# Altium schematic sheet 2_FPGA.SchDoc: AX309 Http://www.heijin.org
size OrCAD A; DocumentNumber: 2; Revision: 1.0; SheetNumber: 2; SheetTotal: 7; PageSetup: Record=PageOptions|CenterHorizontal=True|CenterVertical=True|PrintScale=1.03|XCorrection=1.00|YCorrection=1.00|PrintKind=0|BorderSize=5000000|LeftOffset=0|BottomOffset=0|Orientation=2|PaperLength=1000|PaperWidth=1000|Scale=100|PaperSource=15|PrintQuality=1200|MediaType=1|DitherType=10|PrintScaleMode=1|PaperKind=A4|PaperIndex=9
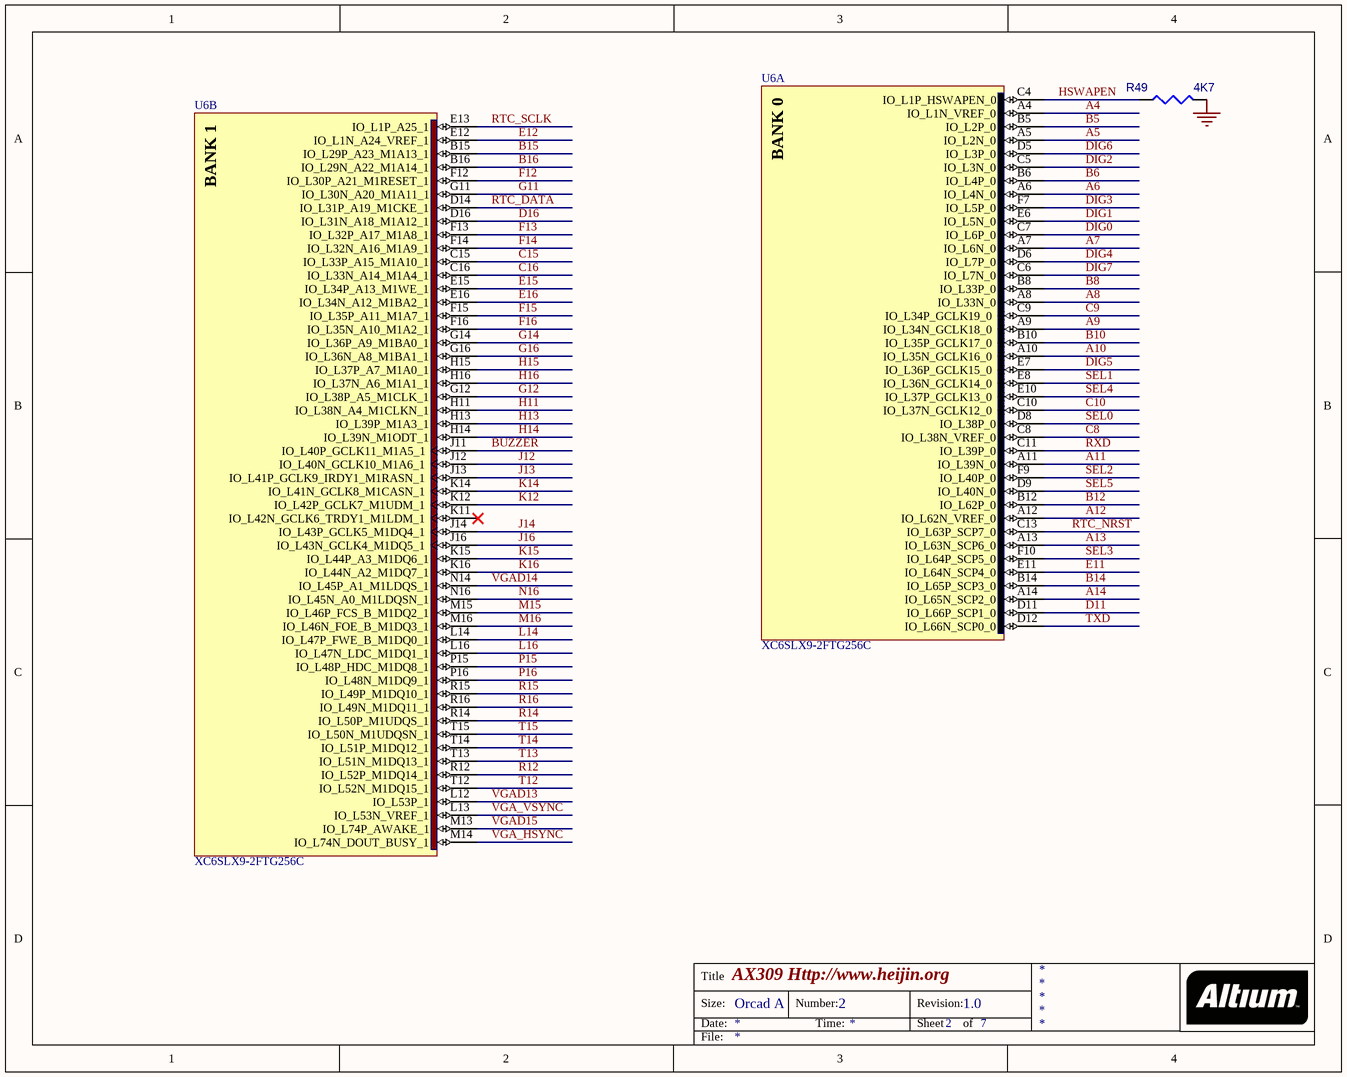
[diagram p0: 2_FPGA.SchDoc]

## Parts
R49  4K7  [0603]
U6  XC6SLX9-2FTG256C  [FTG256]  (parts A,B of 7)

## Nets
GND: R49.2
A4: U6.A4(IO_L1N_VREF_0)
A5: U6.A5(IO_L2N_0)
A6: U6.A6(IO_L4N_0)
A7: U6.A7(IO_L6N_0)
A8: U6.A8(IO_L33N_0)
A9: U6.A9(IO_L34N_GCLK18_0)
A10: U6.A10(IO_L35N_GCLK16_0)
A11: U6.A11(IO_L39N_0)
A12: U6.A12(IO_L62N_VREF_0)
A13: U6.A13(IO_L63N_SCP6_0)
A14: U6.A14(IO_L65N_SCP2_0)
B5: U6.B5(IO_L2P_0)
B6: U6.B6(IO_L4P_0)
B8: U6.B8(IO_L33P_0)
B10: U6.B10(IO_L35P_GCLK17_0)
B12: U6.B12(IO_L62P_0)
B14: U6.B14(IO_L65P_SCP3_0)
B15: U6.B15(IO_L29P_A23_M1A13_1)
B16: U6.B16(IO_L29N_A22_M1A14_1)
BUZZER: U6.J11(IO_L40P_GCLK11_M1A5_1)
C8: U6.C8(IO_L38N_VREF_0)
C9: U6.C9(IO_L34P_GCLK19_0)
C10: U6.C10(IO_L37N_GCLK12_0)
C15: U6.C15(IO_L33P_A15_M1A10_1)
C16: U6.C16(IO_L33N_A14_M1A4_1)
D11: U6.D11(IO_L66P_SCP1_0)
D16: U6.D16(IO_L31N_A18_M1A12_1)
DIG0: U6.C7(IO_L6P_0)
DIG1: U6.E6(IO_L5N_0)
DIG2: U6.C5(IO_L3N_0)
DIG3: U6.F7(IO_L5P_0)
DIG4: U6.D6(IO_L7P_0)
DIG5: U6.E7(IO_L36P_GCLK15_0)
DIG6: U6.D5(IO_L3P_0)
DIG7: U6.C6(IO_L7N_0)
E11: U6.E11(IO_L64N_SCP4_0)
E12: U6.E12(IO_L1N_A24_VREF_1)
E15: U6.E15(IO_L34P_A13_M1WE_1)
E16: U6.E16(IO_L34N_A12_M1BA2_1)
F12: U6.F12(IO_L30P_A21_M1RESET_1)
F13: U6.F13(IO_L32P_A17_M1A8_1)
F14: U6.F14(IO_L32N_A16_M1A9_1)
F15: U6.F15(IO_L35P_A11_M1A7_1)
F16: U6.F16(IO_L35N_A10_M1A2_1)
G11: U6.G11(IO_L30N_A20_M1A11_1)
G12: U6.G12(IO_L38P_A5_M1CLK_1)
G14: U6.G14(IO_L36P_A9_M1BA0_1)
G16: U6.G16(IO_L36N_A8_M1BA1_1)
H11: U6.H11(IO_L38N_A4_M1CLKN_1)
H13: U6.H13(IO_L39P_M1A3_1)
H14: U6.H14(IO_L39N_M1ODT_1)
H15: U6.H15(IO_L37P_A7_M1A0_1)
H16: U6.H16(IO_L37N_A6_M1A1_1)
HSWAPEN: R49.1 U6.C4(IO_L1P_HSWAPEN_0)
J12: U6.J12(IO_L40N_GCLK10_M1A6_1)
J13: U6.J13(IO_L41P_GCLK9_IRDY1_M1RASN_1)
J14: U6.J14(IO_L43P_GCLK5_M1DQ4_1)
J16: U6.J16(IO_L43N_GCLK4_M1DQ5_1)
K12: U6.K12(IO_L42P_GCLK7_M1UDM_1)
K14: U6.K14(IO_L41N_GCLK8_M1CASN_1)
K15: U6.K15(IO_L44P_A3_M1DQ6_1)
K16: U6.K16(IO_L44N_A2_M1DQ7_1)
L14: U6.L14(IO_L47P_FWE_B_M1DQ0_1)
L16: U6.L16(IO_L47N_LDC_M1DQ1_1)
M15: U6.M15(IO_L46P_FCS_B_M1DQ2_1)
M16: U6.M16(IO_L46N_FOE_B_M1DQ3_1)
N16: U6.N16(IO_L45N_A0_M1LDQSN_1)
P15: U6.P15(IO_L48P_HDC_M1DQ8_1)
P16: U6.P16(IO_L48N_M1DQ9_1)
R12: U6.R12(IO_L52P_M1DQ14_1)
R14: U6.R14(IO_L50P_M1UDQS_1)
R15: U6.R15(IO_L49P_M1DQ10_1)
R16: U6.R16(IO_L49N_M1DQ11_1)
RTC_DATA: U6.D14(IO_L31P_A19_M1CKE_1)
RTC_NRST: U6.C13(IO_L63P_SCP7_0)
RTC_SCLK: U6.E13(IO_L1P_A25_1)
RXD: U6.C11(IO_L39P_0)
SEL0: U6.D8(IO_L38P_0)
SEL1: U6.E8(IO_L36N_GCLK14_0)
SEL2: U6.F9(IO_L40P_0)
SEL3: U6.F10(IO_L64P_SCP5_0)
SEL4: U6.E10(IO_L37P_GCLK13_0)
SEL5: U6.D9(IO_L40N_0)
T12: U6.T12(IO_L52N_M1DQ15_1)
T13: U6.T13(IO_L51N_M1DQ13_1)
T14: U6.T14(IO_L51P_M1DQ12_1)
T15: U6.T15(IO_L50N_M1UDQSN_1)
TXD: U6.D12(IO_L66N_SCP0_0)
VGA_HSYNC: U6.M14(IO_L74N_DOUT_BUSY_1)
VGA_VSYNC: U6.L13(IO_L53N_VREF_1)
VGAD13: U6.L12(IO_L53P_1)
VGAD14: U6.N14(IO_L45P_A1_M1LDQS_1)
VGAD15: U6.M13(IO_L74P_AWAKE_1)

Not connected (* = marked no-connect by the designer): U6 K11(IO_L42N_GCLK6_TRDY1_M1LDM_1)*

## Notes on the sheet
- Title
- Size:
- Date:
- Orcad A
- Number:
- Time:
- Revision:
- Sheet
- of
- File:
- (in symbol XC6SLX9-2FTG256C, part A) BANK 0
- (in symbol XC6SLX9-2FTG256C, part B) BANK 1

## Library data of the parts
R49 = R
U6 = XC6SLX9-2FTG256C: Spartan-6 LX 1.2V FPGA, 186 User I/Os, 256-Ball Fine-Pitch Thin BGA (1.0mm Pitch), Speed Grade 2, Commercial Grade, Pb-Free; DatasheetVersion: ver1.6, Nov-2010; PackageVersion: ver1.3, Oct-2007; PackageReference: FTG256; PackageDescription: 256-Ball Fine Pitch Thin Ball Grid Array 1.00 mm Pitch (FTG256) - Pb-Free; Code_JEDEC: MS-034-AAF-1*; ComponentLink1Description: Manufacturer URL; ComponentLink1URL: http://www.xilinx.com/; ComponentLink2Description: Spartan-6 Datasheet; ComponentLink2URL: http://www.xilinx.com/support/documentation/data_sheets/ds160.pdf; ComponentLink3Description: Spartan-6 Documents; ComponentLink3URL: http://www.xilinx.com/support/documentation/spartan-6.htm